# EAGLE design AUDINO SHIELD (EAGLE 9.6.2)
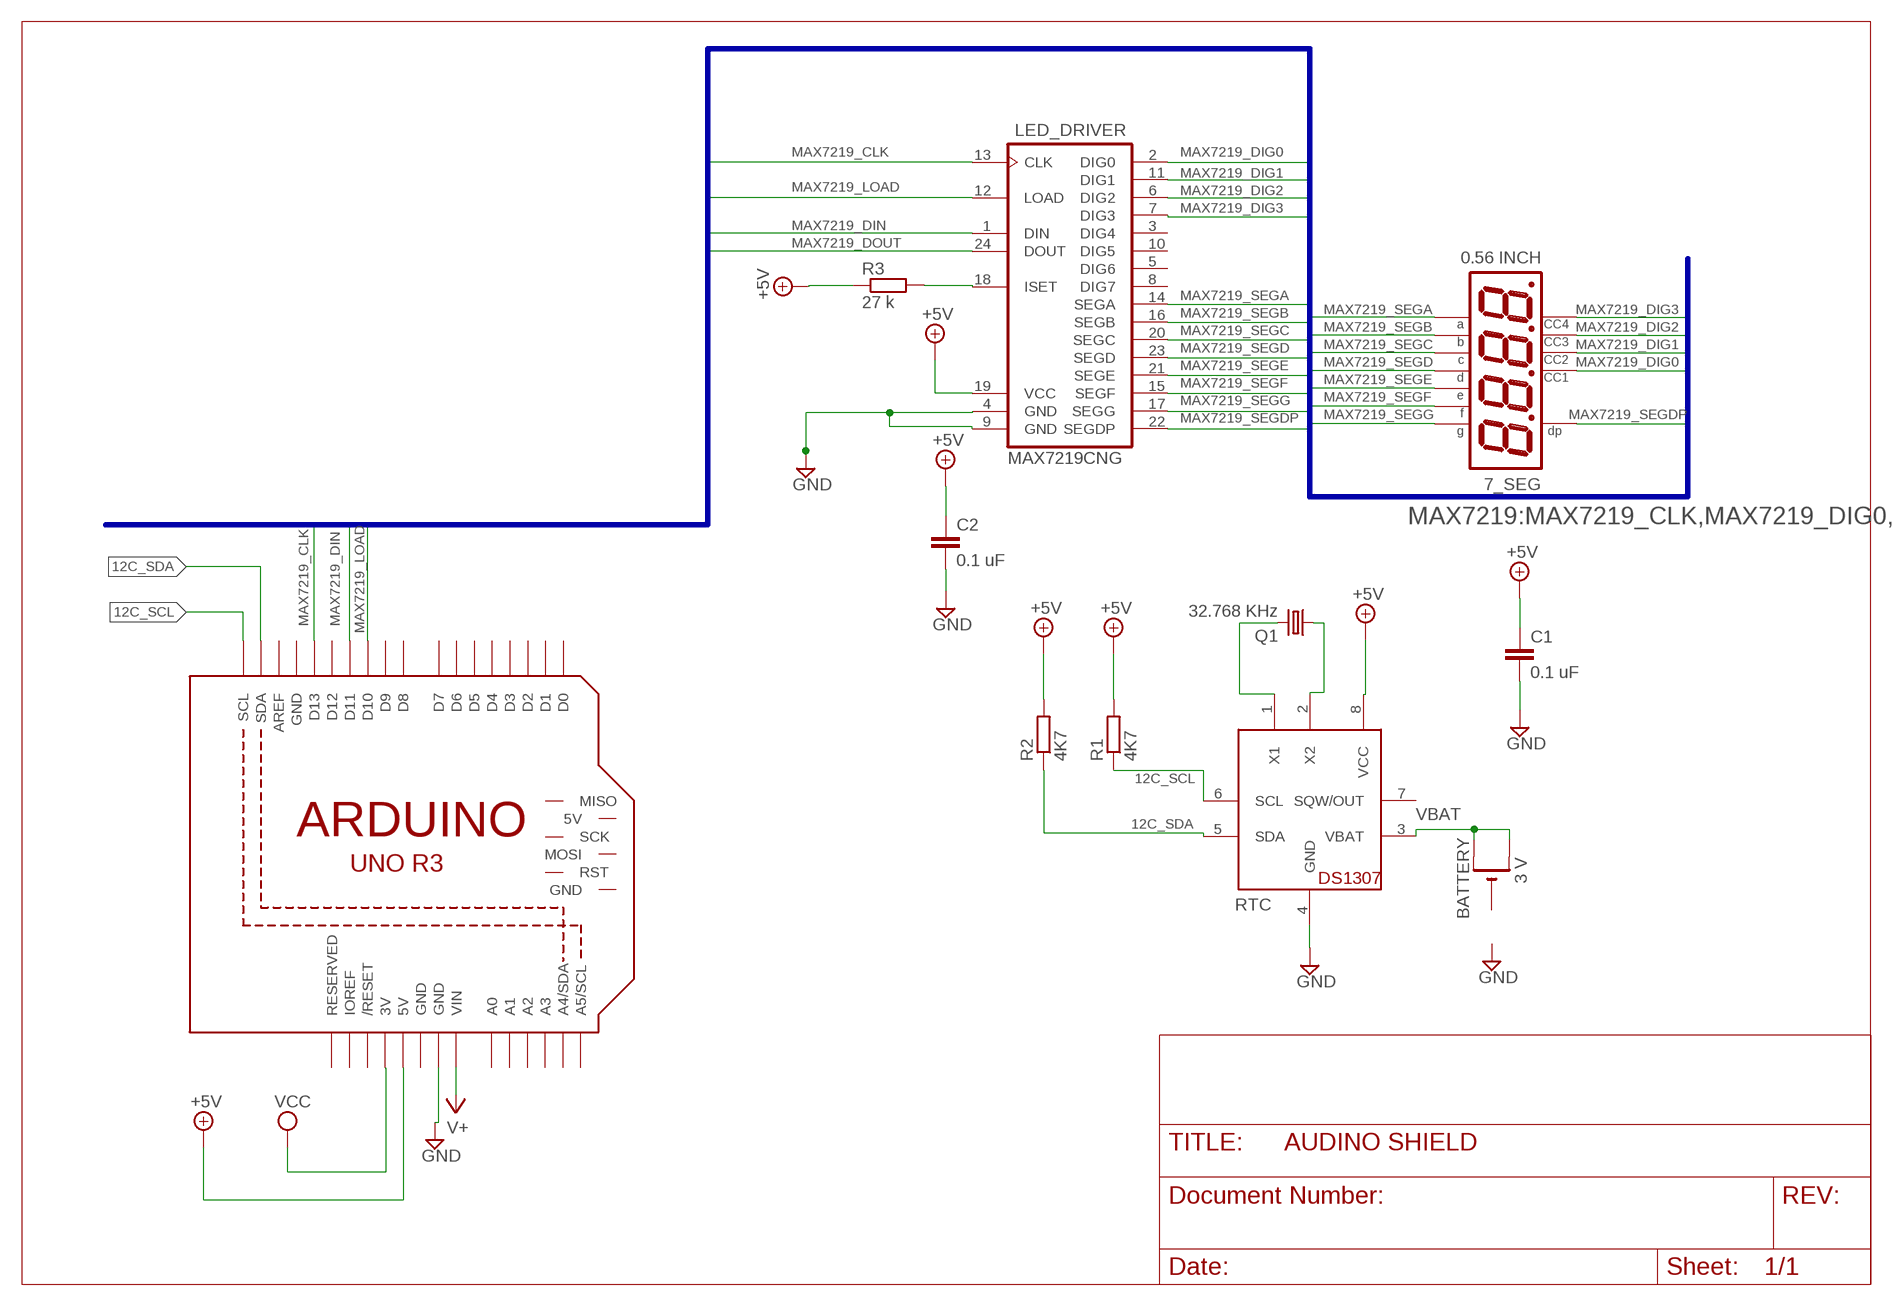
[diagram p0: schematic, sheet 1]

## Parts
7_SEG  0.56 INCH  NFD-5641AS  [NFD-5641]
BATTERY  3 V  CR1220SMT  [CR1220-SMD]
C1  0.1 uF  C-EU050-030X075  [C050-030X075]
C2  0.1 uF  C-EUC1206  [C1206]
LED_DRIVER  MAX7219CNG  [DIL24-3]
M1  ARDUINO_R3_ICSP  [ARDUINOR3_ICSP]
Q1  32.768 KHz  CRYSTALTC26H  [TC26H]
R1  4K7  R-EU_R1206  [R1206]
R2  4K7  R-EU_R1206  [R1206]
R3  27 k  R-EU_R1206  [R1206]
RTC  DS1307  [DIL08]

## Nets
12C_SCL: M1.SCL R1.1 RTC.6(SCL)
12C_SDA: M1.SDA R2.1 RTC.5(SDA)
+5V [POWER]: C1.1 C2.1 LED_DRIVER.19(VCC) M1.5V R1.2 R2.2 R3.1 RTC.8(VCC)
GND [POWER]: C1.2 C2.2 LED_DRIVER.4(GND) LED_DRIVER.9(GND) M1.GND@3(GND) RTC.4(GND)
MAX7219_CLK [MAX7219 NET]: LED_DRIVER.13(CLK) M1.D13
MAX7219_DIG0 [MAX7219 NET]: 7_SEG.P$12 LED_DRIVER.2(DIG0)
MAX7219_DIG1 [MAX7219 NET]: 7_SEG.P$9 LED_DRIVER.11(DIG1)
MAX7219_DIG2 [MAX7219 NET]: 7_SEG.P$8 LED_DRIVER.6(DIG2)
MAX7219_DIG3 [MAX7219 NET]: 7_SEG.P$6 LED_DRIVER.7(DIG3)
MAX7219_DIN [MAX7219 NET]: LED_DRIVER.1(DIN) M1.D11
MAX7219_DOUT [MAX7219 NET]: LED_DRIVER.24(DOUT)
MAX7219_LOAD [MAX7219 NET]: LED_DRIVER.12(LOAD) M1.D10
MAX7219_SEGA [MAX7219 NET]: 7_SEG.P$11 LED_DRIVER.14(SEGA)
MAX7219_SEGB [MAX7219 NET]: 7_SEG.P$7 LED_DRIVER.16(SEGB)
MAX7219_SEGC [MAX7219 NET]: 7_SEG.P$4 LED_DRIVER.20(SEGC)
MAX7219_SEGD [MAX7219 NET]: 7_SEG.P$2 LED_DRIVER.23(SEGD)
MAX7219_SEGDP [MAX7219 NET]: 7_SEG.P$3 LED_DRIVER.22(SEGDP)
MAX7219_SEGE [MAX7219 NET]: 7_SEG.P$1 LED_DRIVER.21(SEGE)
MAX7219_SEGF [MAX7219 NET]: 7_SEG.P$10 LED_DRIVER.15(SEGF)
MAX7219_SEGG [MAX7219 NET]: 7_SEG.P$5 LED_DRIVER.17(SEGG)
N$1: LED_DRIVER.18(ISET) R3.2
N$4: Q1.2 RTC.1(X1)
N$5: Q1.1 RTC.2(X2)
V+: M1.VIN
VBAT [POWER]: BATTERY.+$1(+) BATTERY.+$2(+1) RTC.3(VBAT)
VCC [POWER]: M1.3V
Unconnected: BATTERY.- LED_DRIVER.3(DIG4) LED_DRIVER.5(DIG6) LED_DRIVER.8(DIG7) LED_DRIVER.10(DIG5) M1.5V_ICSP(5V) M1.A0 M1.A1 M1.A2 M1.A3 M1.A4(A4/SDA) M1.A5(A5/SCL) M1.AREF M1.D0 M1.D1 M1.D2 M1.D3 M1.D4 M1.D5 M1.D6 M1.D7 M1.D8 M1.D9 M1.D12 M1.GND@2(GND) M1.IOREF M1.MISO M1.MOSI M1.RESERVED M1.RESET(/RESET) M1.RESET_ICSP(RST) M1.SCK RTC.7(SQW/OUT)

## Buses
MAX7219:MAX7219_CLK,MAX7219_DIG0,MAX7219_DIG1,MAX7219_DIG2,MAX7219_DIG3,MAX7219_DIG4,MAX7219_DIG5,MAX7219_DIG6,MAX7219_DIG7,MAX7219_DIN,MAX7219_DOUT,MAX7219_LOAD,MAX7219_SEGA,MAX7219_SEGB,MAX7219_SEGC,MAX7219_SEGD,MAX7219_SEGDP,MAX7219_SEGE,MAX7219_SEGF,MAX7219_SEGG

## Power pins joined to a net without a drawn wire
GND: M1.GND M1.GND@1(GND)

## Library data of the parts
7_SEG = display-nfd:NFD-5641AS: Four Digit 0.56" CC Seven-Segment LED Display Futurlec part number: 7FR5641AS Created by RobG
BATTERY = adafruit:CR1220: CR1216/CR1220/CR1225 12mm 3V lithium coin cell Great for battery packup. Both SMT and THM holders. Note the THM package has the ground pads on both sides of the PCB so that the masks are the same - this reduces the cost
C1 C2 = rcl:C-EU: CAPACITOR, European symbol; SPICEPREFIX: C
LED_DRIVER = maxim:MAX7219CNG: LED DISPLAY DRIVER; MF: MAXIM; MPN: MAX7219CNG; OC_FARNELL: 1523914; OC_NEWARK: 34C4018
M1 = adafruit:ARDUINO_R3_ICSP
Q1 = adafruit:CRYSTAL: CRYSTAL; OC_FARNELL: unknown; OC_NEWARK: unknown
R1-R3 = rcl:R-EU_: RESISTOR, European symbol; SPICEPREFIX: R
RTC = adafruit:DS1307: DS1307 Real time clock (RTC) with battery backup ability. Talk to it via i2c

## Net classes
0 default: width 0.254 mm, drill 0.406 mm, clearance 0.254 mm
1 MAX7219 NET: width 0.203 mm, drill 0.406 mm, clearance 0.203 mm
2 POWER: width 0.406 mm, drill 0.406 mm, clearance 0.305 mm

## Board
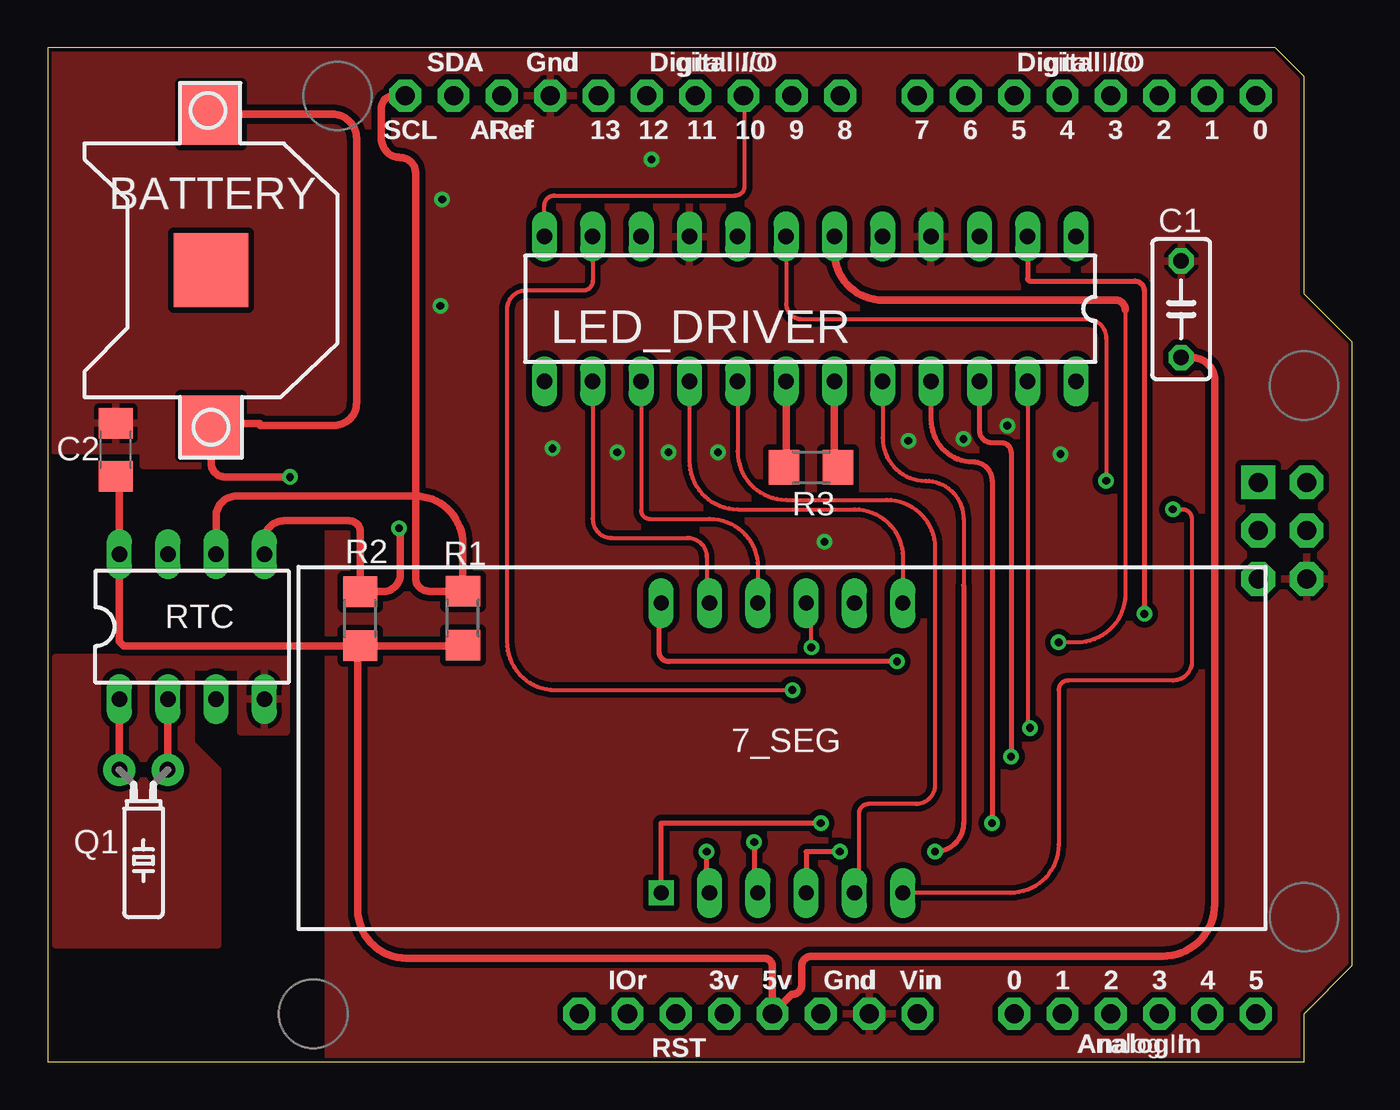
[diagram p1: board, top side]
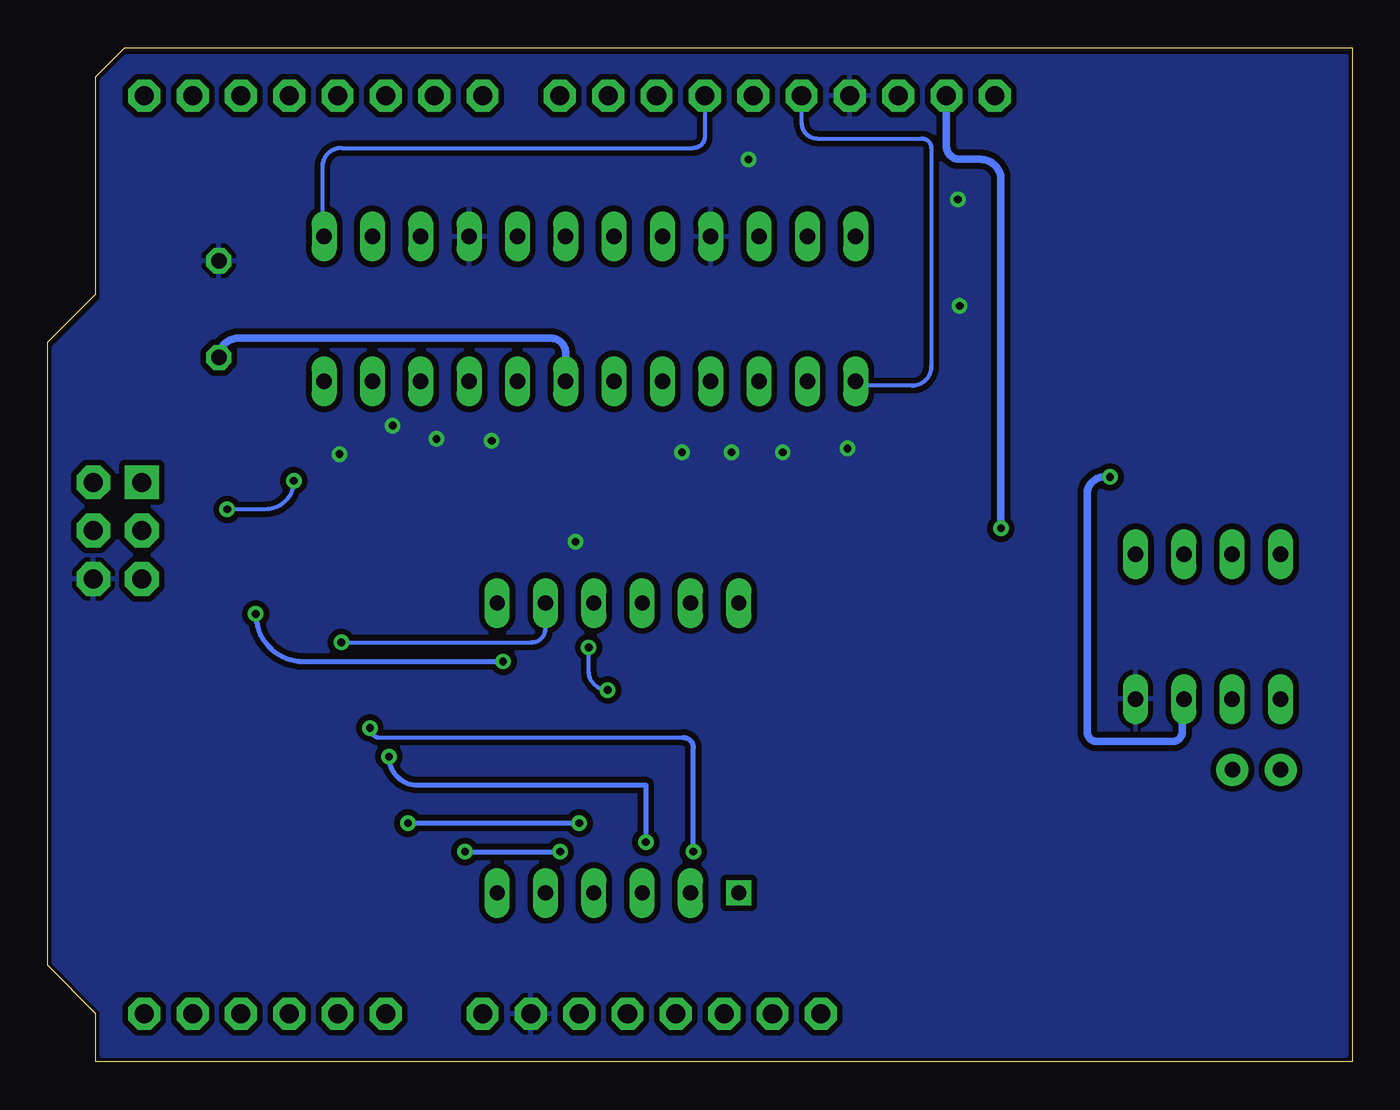
[diagram p2: board, bottom side, seen from below]

Size 68.58 x 53.34 mm. Coordinates in mm from the lower left corner, seen from the top.
Copper layers (1*16): Top 0.035mm / dielectric 1.5mm / Bottom 0.035mm
Design rules "default *": minimum track width 8mil, minimum drill 0.35mm, track to track 8mil, track to pad 8mil, pad to pad 8mil, via to via 8mil, smd to smd 8mil, copper to edge 8mil, drill to drill 6mil, minimum pad ring 10mil, minimum via ring 8mil, stop-mask expansion 4mil, vias tented up to drill 0mil, thermal gap 10mil

### Footprints (pad centres in the part's own frame; a part is rotated, then mirrored left to right if it is on the bottom)
NFD-5641 = drill 0.8 square: P$1 -6.35,-7.62 | drill 0.8 long: P$2 -3.81,-7.62; P$3 -1.27,-7.62; P$4 1.27,-7.62; P$5 3.81,-7.62; P$6 6.35,-7.62; P$7 6.35,7.62; P$8 3.81,7.62; P$9 1.27,7.62; P$10 -1.27,7.62; P$11 -3.81,7.62; P$12 -6.35,7.62
CR1220-SMD = smd 3.2 x 3.2: +$1 -8.2,0; +$2 8.2,0 | smd 3.9 x 3.9: - 0,0
C050-030X075 = drill 0.813 octagon: 1 -2.54,0; 2 2.54,0
C1206 = smd 1.6 x 1.8: 1 -1.4,0; 2 1.4,0
DIL24-3 = drill 0.813 long: 1 -13.97,-3.81; 2 -11.43,-3.81; 3 -8.89,-3.81; 4 -6.35,-3.81; 5 -3.81,-3.81; 6 -1.27,-3.81; 7 1.27,-3.81; 8 3.81,-3.81; 9 6.35,-3.81; 10 8.89,-3.81; 11 11.43,-3.81; 12 13.97,-3.81; 13 13.97,3.81; 14 11.43,3.81; 15 8.89,3.81; 16 6.35,3.81; 17 3.81,3.81; 18 1.27,3.81; 19 -1.27,3.81; 20 -3.81,3.81; 21 -6.35,3.81; 22 -8.89,3.81; 23 -11.43,3.81; 24 -13.97,3.81
ARDUINOR3_ICSP = drill 1 pad 1.676 octagon: 3V 35.56,2.54; 5V 38.1,2.54; A0 50.8,2.54; A1 53.34,2.54; A2 55.88,2.54; A3 58.42,2.54; A4 60.96,2.54; A5 63.5,2.54; AREF 23.876,50.8; D0 63.5,50.8; D1 60.96,50.8; D2 58.42,50.8; D3 55.88,50.8; D4 53.34,50.8; D5 50.8,50.8; D6 48.26,50.8; D7 45.72,50.8; D8 41.656,50.8; D9 39.116,50.8; D10 36.576,50.8; D11 34.036,50.8; D12 31.496,50.8; D13 28.956,50.8; GND 26.416,50.8; GND@1 43.18,2.54; GND@2 40.64,2.54; IOREF 30.48,2.54; RESERVED 27.94,2.54; RESET 33.02,2.54; SCL 18.796,50.8; SDA 21.336,50.8; VIN 45.72,2.54 | drill 1 pad 1.778 octagon: 5V_ICSP 66.167,30.48; GND@3 66.167,25.4; MOSI 66.167,27.94; RESET_ICSP 63.627,25.4; SCK 63.627,27.94 | drill 1 pad 1.778 square: MISO 63.627,30.48
TC26H = drill 0.813 pad 1.676: 1 -1.27,0; 2 1.27,0
R1206 = smd 1.6 x 1.803: 1 -1.422,0; 2 1.422,0
DIL08 = drill 0.813 long: 1 -3.81,-3.81; 2 -1.27,-3.81; 3 1.27,-3.81; 4 3.81,-3.81; 5 3.81,3.81; 6 1.27,3.81; 7 -1.27,3.81; 8 -3.81,3.81

### Placement (x,y rotation side)
7_SEG  38.6,16.51 0 top
BATTERY  8.59,41.63 90 top
C1  59.58,39.58 90 top
C2  3.58,32.19 90 top
LED_DRIVER  40.08,39.6 180 top
M1  0,0 0 top
Q1  5.04,15.36 180 top
R1  21.83,23.33 270 top
R2  16.43,23.31 270 top
R3  40.13,31.27 180 top
RTC  7.59,22.89 0 top

### Tracks (layer width: path | path; a pad name or v marks a point on that pad's centre or on a via)
12C_SCL
  Top 0.406: RTC.6 8.86,28.68 arc-90 9.94,29.76 19.29,29.76 arc-90 21.83,27.22 R1.1 20.05,24.75 arc-90 19.34,25.46 19.34,46.76 arc90 18.54,47.56 arc-90 17.54,48.56 17.54,50.16 arc-90 18.18,50.8 M1.SCL
12C_SDA  (via drill 0.41)
  Top 0.406: RTC.5 11.4,27.42 arc-90 12.44,28.46 15.84,28.46 arc-90 16.44,27.86 16.44,24.74 arc-90 R2.1 17.61,24.73 arc90 18.54,25.66 18.54,28 arc90 v18.48,28.06
  Bottom 0.406: v18.48,28.06 18.48,46.4 arc-90 19.54,47.46 20.64,47.46 arc90 21.34,48.16 M1.SDA arc90 M1.SDA
+5V
  Top 0.406: C1.1 60.16,37.04 arc-90 61.34,35.86 61.34,8.3 arc-90 58.6,5.56 40.14,5.56 arc90 39.64,5.06 39.64,4.06 arc-90 39.14,3.56 39.12,3.56 M1.5V 38.1,5 arc90 37.64,5.46 18.84,5.46 arc-90 16.3,8 16.3,21.76 R2.2 | LED_DRIVER.19 41.35,31.47 arc90 R3.1 | C2.1 arc-90 3.78,30.59 RTC.8 3.78,22.12 4.01,21.89 R2.2 | R2.2 21.81,21.89 R1.2
  Bottom 0.406: LED_DRIVER.19 41.35,37.27 arc-90 42.14,38.06 58.56,38.06 arc-90 C1.1
GND  (via drill 0.41)
  other vias: 40.84,27.36 45.24,32.66 48.14,32.76 50.44,33.46 53.24,31.96 35.24,32.06 32.64,32.06 29.94,32.06 26.54,32.26 31.74,47.46 20.74,45.36 20.64,39.76
  pour Top: 0.44,20.56 0.44,6.16 8.94,6.16 8.94,15.36 7.54,16.76 7.54,17.36 7.54,20.56 7.54,20.76 10.14,20.76 10.14,17.56 10.14,17.36 12.54,17.36 12.54,21.26 0.44,21.26
  pour Top: 0.34,53.16 64.14,53.16 65.64,51.66 65.64,40.26 68.24,37.66 68.24,5.16 65.74,2.66 65.74,0.26 14.74,0.26 14.74,31.36 5.04,31.36 5.04,32.16 0.34,32.16
  pour Bottom: 0.34,52.86 64.44,52.86 65.74,51.56 65.74,40.06 68.34,37.46 68.34,5.26 65.74,2.66 65.74,0.36 0.34,0.36 0.24,0.46 0.24,52.76
MAX7219_CLK
  Bottom 0.203: M1.D13 28.96,49.38 arc-90 28.14,48.56 22.64,48.56 arc90 22.14,48.06 22.14,36.56 arc90 23.14,35.56 25.88,35.56 arc90 LED_DRIVER.13
MAX7219_DIG0  (via drill 0.41)
  Top 0.254: LED_DRIVER.2 51.51,41.19 arc90 51.64,41.06 57.14,41.06 arc-90 57.64,40.56 v57.64,23.56 | v44.64,21.06 32.64,21.06 arc-90 32.14,21.56 32.14,24.02 arc-90 7_SEG.P$12
  Bottom 0.254: v57.64,23.56 arc-90 55.14,21.06 v44.64,21.06
MAX7219_DIG1  (via drill 0.41)
  Top 0.203: LED_DRIVER.11 28.65,41.07 arc-90 28.14,40.56 25.14,40.56 arc90 24.14,39.56 24.14,22.1 arc90 26.68,19.56 v39.14,19.56 | v40.14,21.8 40.14,23.86 arc90 7_SEG.P$9
  Bottom 0.203: v39.14,19.56 arc90 40.14,20.56 v40.14,21.8
MAX7219_DIG2  (via drill 0.41)
  Top 0.203: 56.64,39.56 56.64,24.6 arc-90 54.1,22.06 v53.14,22.06
  Top 0.406: LED_DRIVER.6 41.35,42.6 arc90 43.89,40.06 56.14,40.06 arc-90 56.64,39.56
  Bottom 0.203: v53.14,22.06 43.14,22.06 arc-90 42.41,22.79 7_SEG.P$8
MAX7219_DIG3  (via drill 0.41)
  Top 0.203: LED_DRIVER.7 38.81,39.89 arc90 39.64,39.06 54.64,39.06 arc-90 55.64,38.06 v55.64,30.56 | v59.14,29.06 59.64,29.06 arc-90 60.14,28.56 60.14,21.06 arc-90 59.14,20.06 53.64,20.06 arc90 53.14,19.56 53.14,11.43 arc-90 50.6,8.89 7_SEG.P$6
  Bottom 0.203: v55.64,30.56 arc90 57.14,29.06 v59.14,29.06
MAX7219_DIN
  Bottom 0.203: M1.D11 34.04,48.66 arc90 34.64,48.06 53.14,48.06 arc-90 54.14,47.06 54.14,43.5 arc-90 LED_DRIVER.1
MAX7219_LOAD
  Top 0.203: LED_DRIVER.12 26.11,45.03 arc-90 26.64,45.56 36.14,45.56 arc90 36.64,46.06 36.64,50.74 arc90 M1.D10
MAX7219_SEGA
  Top 0.203: LED_DRIVER.14 28.65,28.55 arc90 29.64,27.56 33.64,27.56 arc-90 34.64,26.56 34.64,24.28 arc90 7_SEG.P$11
MAX7219_SEGB
  Top 0.203: LED_DRIVER.16 33.73,31.6 arc90 36.27,29.06 42.41,29.06 arc-90 44.95,26.52 7_SEG.P$7
MAX7219_SEGC  (via drill 0.41)
  Top 0.203: LED_DRIVER.20 43.89,32.81 arc90 46.14,30.56 arc-90 48.14,28.56 48.14,25.06
  Top 0.254: 48.14,25.06 48.14,12.56 arc-90 v46.64,11.06 | v41.64,11.06 39.87,11.06 7_SEG.P$4
  Bottom 0.254: v46.64,11.06 v41.64,11.06
MAX7219_SEGD  (via drill 0.41)
  Top 0.203: LED_DRIVER.23 51.51,17.69 arc90 v51.64,17.56
  Top 0.254: 34.64,9.04 arc90 7_SEG.P$2 arc-90 34.64,9.04 | 34.64,9.04 v34.64,11.06
  Bottom 0.203: v51.64,17.56 arc-90 51.14,17.06 35.18,17.06
  Bottom 0.254: 35.18,17.06 arc90 34.64,16.52 v34.64,11.06
MAX7219_SEGDP  (via drill 0.41)
  Top 0.254: LED_DRIVER.22 48.97,33.23 arc90 49.64,32.56 50.14,32.56 arc-90 50.64,32.06 v50.64,16.06 | 7_SEG.P$3 arc-90 37.14,9.08 v37.14,11.56
  Bottom 0.254: v50.64,16.06 arc-90 49.14,14.56 37.14,14.56 v37.14,11.56
MAX7219_SEGE  (via drill 0.41)
  Top 0.254: LED_DRIVER.21 46.43,33.77 arc90 48.64,31.56 arc-90 49.64,30.56 v49.64,12.56 | 7_SEG.P$1 32.25,12.56 v40.64,12.56
  Bottom 0.254: v49.64,12.56 v40.64,12.56
MAX7219_SEGF
  Top 0.203: LED_DRIVER.15 31.19,29.01 arc90 31.64,28.56 34.79,28.56 arc-90 37.33,26.02 7_SEG.P$10
MAX7219_SEGG
  Top 0.203: LED_DRIVER.17 36.27,32.1 arc90 38.81,29.56 44.1,29.56 arc-90 46.64,27.02 46.64,14.56 arc-90 45.64,13.56 43.14,13.56 arc90 42.64,13.06 42.64,9.12 arc-90 7_SEG.P$5
N$1
  Top 0.406: LED_DRIVER.18 38.81,31.37 arc-90 R3.2
N$4
  Top 0.406: RTC.1 Q1.2 arc-90 Q1.2
N$5
  Top 0.406: RTC.2 Q1.1 arc-90 Q1.1
VBAT  (via drill 0.41)
  Top 0.406: BATTERY.+$2 10.74,49.83 10.87,49.83 14.97,49.83 arc-90 16.24,48.56 16.24,34.66 arc-90 15.04,33.46 11.24,33.46 arc-90 11.14,33.56 8.72,33.56 arc90 BATTERY.+$1 arc-90 8.64,33.38 8.59,33.33 8.59,31.51 arc90 9.34,30.76 v12.74,30.76
  Bottom 0.406: v12.74,30.76 13.04,30.76 arc-90 13.94,29.86 13.94,17.36 arc-90 13.44,16.86 9.44,16.86 arc-90 8.94,17.36 8.94,19 arc90 RTC.3

### Text on the board
_tplace: SDA | Gnd | Digital I/O | Digital I/O | 13 | 12 | 11 | 10 | 9 | 8 | 7 | 6 | 5 | 4 | 3 | 2 | 1 | 0 | SCL | ARef | IOr | 3v | 5v | Gnd | Vin | 0 | 1 | 2 | 3 | 4 | 5 | RST | Analog In